# EAGLE design elektrosluch (EAGLE 7.4.0)
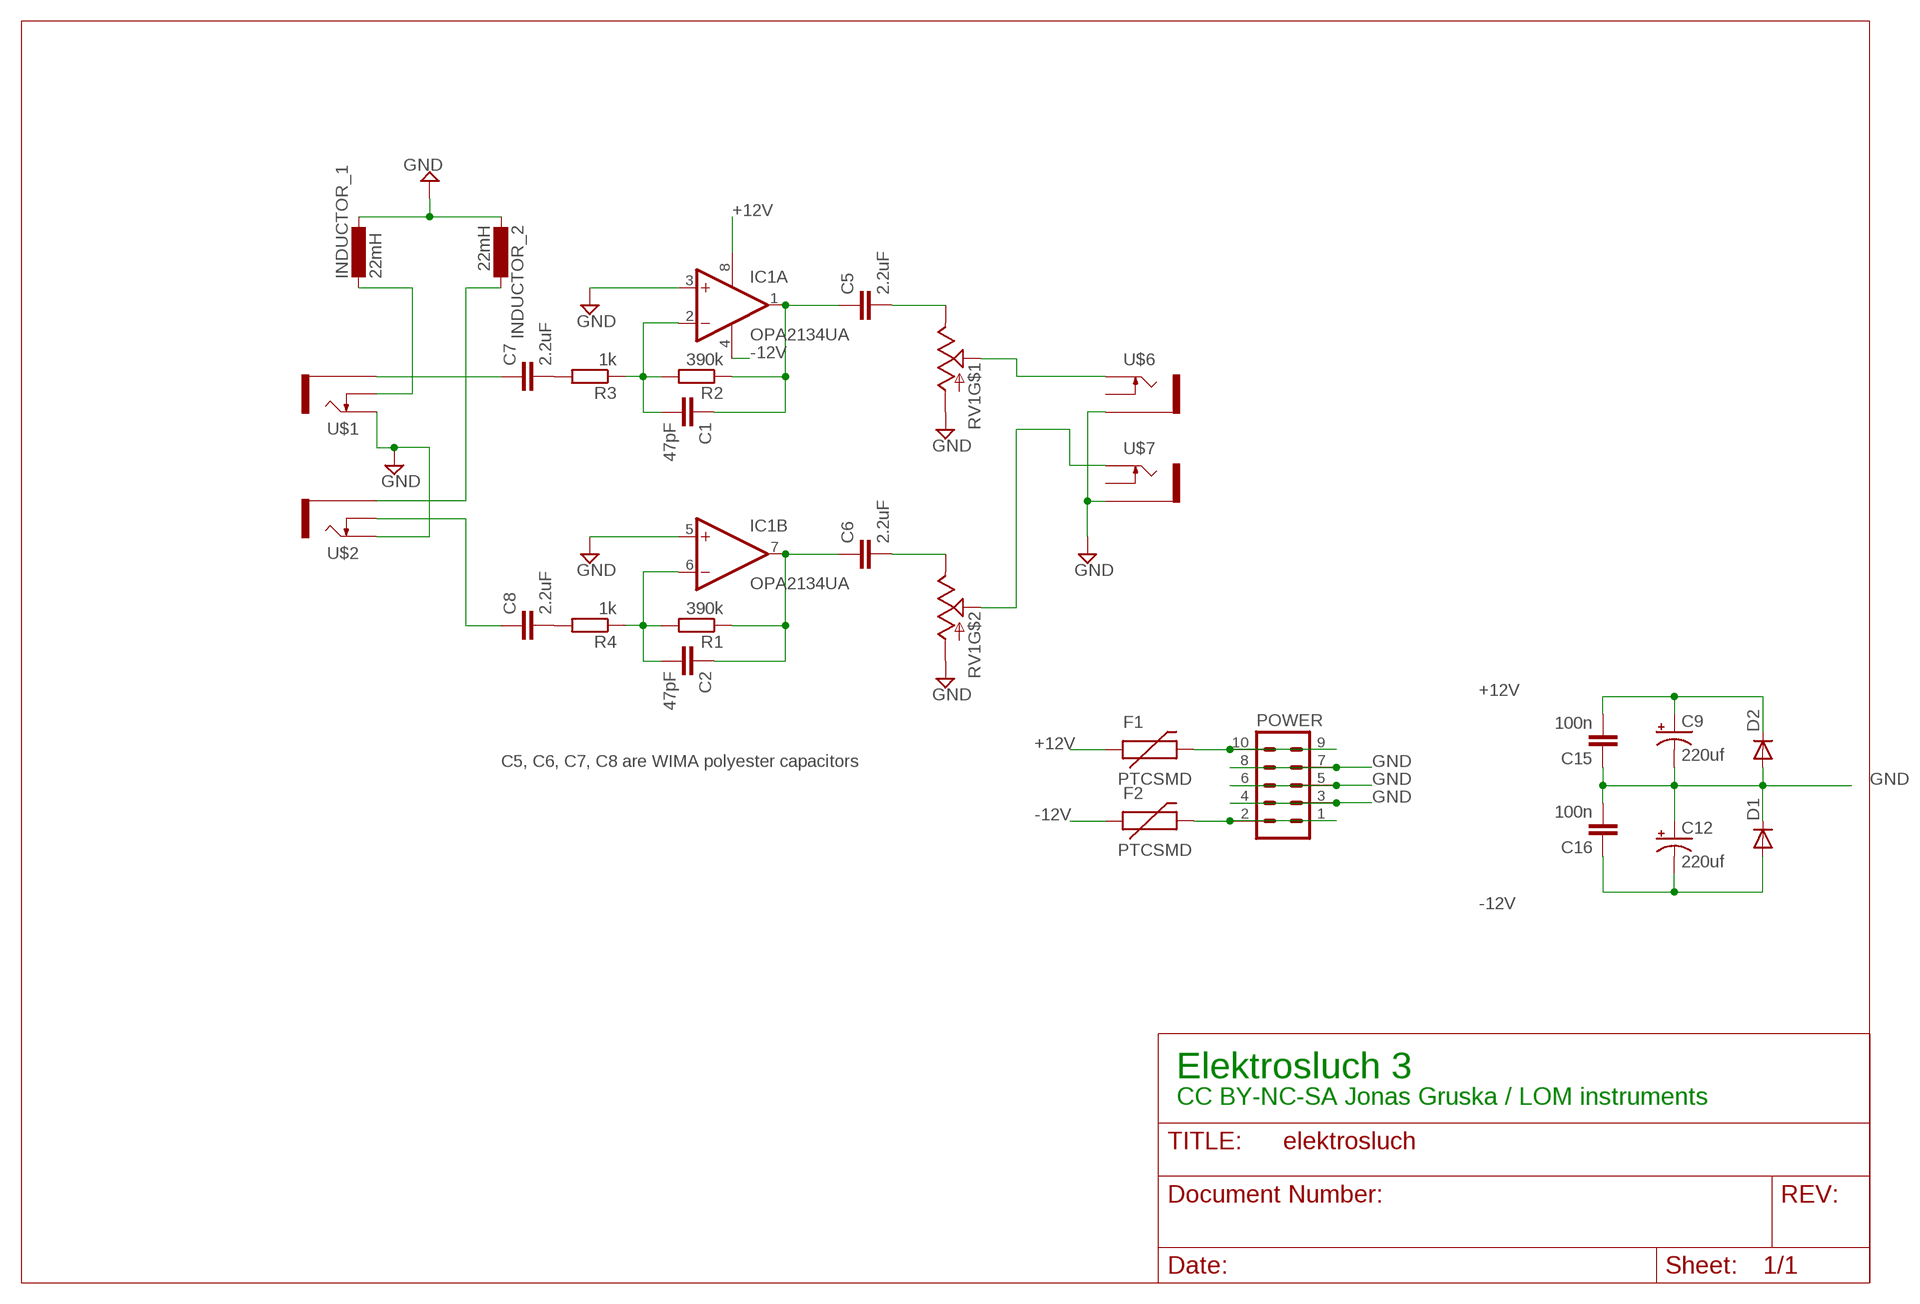
[diagram p0: schematic, sheet 1]

## Parts
C1  47pF  C-EUC0805  [C0805]
C2  47pF  C-EUC0805  [C0805]
C5  2.2uF  WIMA10UF  [WIMA10UF]
C6  2.2uF  WIMA10UF  [WIMA10UF]
C7  2.2uF  WIMA10UF  [WIMA10UF]
C8  2.2uF  WIMA10UF  [WIMA10UF]
C9  220uf  CAP_POLPTH2  [CPOL-RADIAL-10UF-25V]
C12  220uf  CAP_POLPTH2  [CPOL-RADIAL-10UF-25V]
C15  100n  C-EU0805_CAP  [R0805]
C16  100n  C-EU0805_CAP  [R0805]
D1  DIODE-SOD123  [SOD123]
D2  DIODE-SOD123  [SOD123]
F1  PTCSMD  [PTC-1206]
F2  PTCSMD  [PTC-1206]
IC1  OPA2134UA  [SO08]
INDUCTOR_1  22mH  COIL  [COIL]
INDUCTOR_2  22mH  COIL  [COIL]
POWER  10_PIN_HEADER  [MA05-2]
R1  390k  R-EU_R0805  [R0805]
R2  390k  R-EU_R0805  [R0805]
R3  1k  R-EU_R0805  [R0805]
R4  1k  R-EU_R0805  [R0805]
RV1  POT_DUAL  [POT_PANASONIC_DUAL_VERT_KIT]
U$1  THONKICONNNEW  [WQP-PJ301M-12_JACK]
U$2  THONKICONNNEW  [WQP-PJ301M-12_JACK]
U$6  THONKICONNNEW  [WQP-PJ301M-12_JACK]
U$7  THONKICONNNEW  [WQP-PJ301M-12_JACK]

## Nets
+12V: C9.1(+) C15.2 D2.C F1.1 IC1.8(A:V+)
-12V: C12.2(-) C16.1 D1.A F2.1 IC1.4(A:V-)
GND: C9.2(-) C12.1(+) C15.1 C16.2 D1.C D2.A IC1.3(A:+IN) IC1.5(B:+IN) INDUCTOR_1.P$1 INDUCTOR_2.P$2 POWER.3 POWER.4 POWER.5 POWER.6 POWER.7 POWER.8 RV1.A3(A) RV1.B3(A) U$1.P$1_TIP(TIP) U$2.P$1_TIP(TIP) U$6.P$3_SLEEVE(SLEEVE) U$7.P$3_SLEEVE(SLEEVE)
N$1: C1.2 IC1.2(A:-IN) R2.2 R3.1
N$2: C1.1 C5.P$1 IC1.1(A:OUT) R2.1
N$3: C5.P$2 RV1.A1(E)
N$4: C2.2 IC1.6(B:-IN) R1.2 R4.1
N$5: C2.1 C6.P$1 IC1.7(B:OUT) R1.1
N$6: C6.P$2 RV1.B1(E)
N$7: RV1.A2(S) U$6.P$1_TIP(TIP)
N$8: C7.P$1 U$1.P$3_SLEEVE(SLEEVE)
N$9: RV1.B2(S) U$7.P$1_TIP(TIP)
N$10: C8.P$1 U$2.P$2_SWITCH(SWITCH)
N$11: C7.P$2 R3.2
N$12: INDUCTOR_1.P$2 U$1.P$2_SWITCH(SWITCH)
N$13: INDUCTOR_2.P$1 U$2.P$3_SLEEVE(SLEEVE)
N$14: F1.2 POWER.9 POWER.10
N$15: C8.P$2 R4.2
N$16: F2.2 POWER.1 POWER.2
Unconnected: U$6.P$2_SWITCH(SWITCH) U$7.P$2_SWITCH(SWITCH)

## Notes on the sheet
- C5, C6, C7, C8 are WIMA polyester capacitors
- Elektrosluch 3
- CC BY-NC-SA Jonas Gruska / LOM instruments

## Library data of the parts
C1 C2 = rcl:C-EU: CAPACITOR, European symbol
C5-C8 = mojakniznica:WIMA10UF
C9 C12 = SparkFun-Passives:CAP_POL: Capacitor Polarized These are standard SMD and PTH capacitors. Normally 10uF, 47uF, and 100uF in electrolytic and tantalum varieties. Always verify the external diameter of the through hole cap, it varies with capacity, voltage, and manufacturer. The EIA devices should be standard.
C15 C16 = TomW:C-EU: CAPACITOR, European symbol
D1 D2 = diode:DIODE-: DIODE
F1 F2 = SparkFun-PowerIC:PTC: Resettable Fuse PTC Resettable Fuse. Spark Fun Electronics SKU : COM-08357; PROD_ID: RES-11150
IC1 = linear:OPA2*: Dual Operational Amplifier Low Power, Single-Supply, Rail-To-Rail Operational Amplifier Source: http://focus.ti.com/lit/ds/symlink/opa2345.pdf http://focus.ti.com .. opa241.pdf http://focus.ti.com/lit/ds/symlink/opa2134.pdf
INDUCTOR_1 INDUCTOR_2 = mojakniznica:COIL
POWER = TomW:10_PIN_HEADER: PIN HEADER; OC_FARNELL: unknown; OC_NEWARK: unknown
R1-R4 = rcl:R-EU_: RESISTOR, European symbol
RV1 = SparkFun-Electromechanical:POT_DUAL; DIST: digikey; DIST_ID: P2A5103-ND; PROD_ID: RES-11897
U$1 U$2 U$6 U$7 = MusicThingModular:THONKICONN: 3.5mm socket for Eurorack modular synths

## Net classes
0 default1: width 0.305 mm
1 power1: width 0.61 mm
2 ground1: width 0.61 mm
3 power: width 0.305 mm

## Board
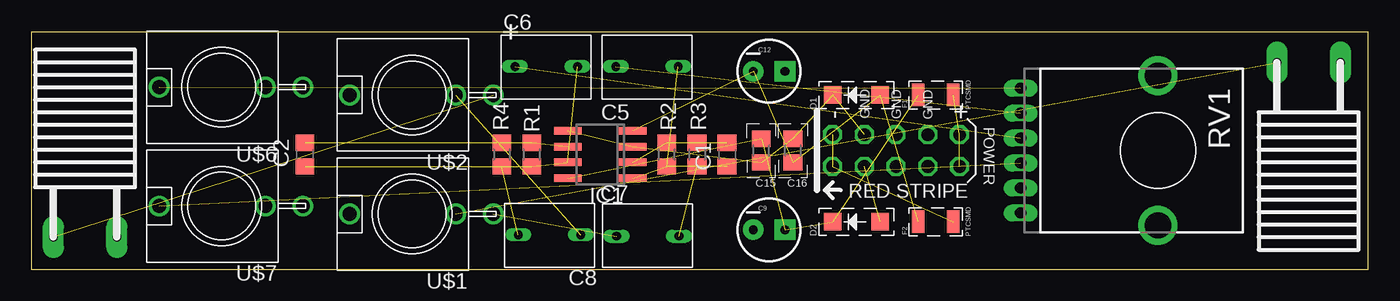
[diagram p1: board, top side]
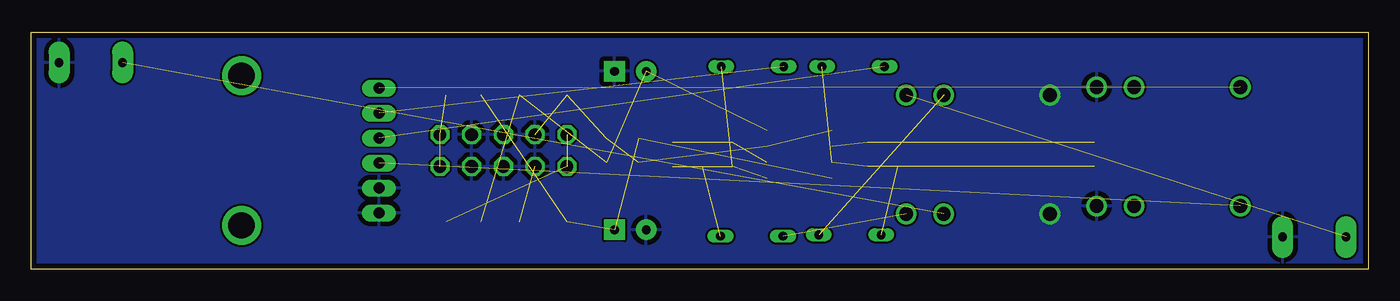
[diagram p2: board, bottom side, seen from below]

Size 107 x 19 mm. Coordinates in mm from the lower left corner, seen from the top.
Outline: 0,0 107,0 107,19 0,19 0,0
Copper layers (1*16): Top 0.0356mm / dielectric 1.5011mm / Bottom 0.0356mm
Design rules "LaenPCBOrder *": minimum track width 6mil, minimum drill 13mil, track to track 6mil, track to pad 6mil, pad to pad 6mil, via to via 6mil, smd to smd 6mil, copper to edge 15mil, drill to drill 6mil, minimum pad ring 7mil, minimum via ring 7mil, stop-mask expansion 3mil, vias tented up to drill 0mil, thermal gap 15mil

### Footprints (pad centres in the part's own frame; a part is rotated, then mirrored left to right if it is on the bottom)
C0805 = smd 1.3 x 1.5: 1 -0.95,0; 2 0.95,0
WIMA10UF = drill 0.7 long: P$1 -2.5,0; P$2 2.5,0
CPOL-RADIAL-10UF-25V = drill 0.7 pad 1.651 square: 1 1.27,0 | drill 0.7 pad 1.651: 2 -1.27,0
R0805 = smd 1.3 x 1.5: 1 -0.95,0; 2 0.95,0
SOD123 = smd 1.4 x 1.4: A 1.9,0; C -1.9,0
PTC-1206 = smd 1 x 1.8: 1 -1.4,0; 2 1.4,0
SO08 = smd 0.6 x 2.2: 1 -1.905,-2.6; 2 -0.635,-2.6; 3 0.635,-2.6; 4 1.905,-2.6; 5 1.905,2.6; 6 0.635,2.6; 7 -0.635,2.6; 8 -1.905,2.6
COIL = drill 0.7 pad 1.676 long: P$1 -2.54,0; P$2 2.54,0
MA05-2 = drill 1.016 octagon: 1 -5.08,-1.27; 2 -5.08,1.27; 3 -2.54,-1.27; 4 -2.54,1.27; 5 0,-1.27; 6 0,1.27; 7 2.54,-1.27; 8 2.54,1.27; 9 5.08,-1.27; 10 5.08,1.27
POT_PANASONIC_DUAL_VERT_KIT = drill 0.9 long: A1 11,-3; A2 11,-5; A3 11,5; B1 11,-1; B2 11,1; B3 11,3 | drill 2.1: P$4 0,-6; P$5 0,6
WQP-PJ301M-12_JACK = drill 1.1: P$1_TIP 0,5; P$2_SWITCH 0,-3.5; P$3_SLEEVE 0,-6.5

### Placement (x,y rotation side)
C1  55.69,9.21 90 top
C2  21.91,9.21 90 top
C5  49.28,16.26 180 top
C6  41.21,16.26 180 top
C7  49.34,2.67 0 top
C8  41.48,2.77 180 top
C9  59.05,3.17 0 top
C12  59.05,15.88 0 top
C15  58.42,9.53 90 top
C16  60.96,9.53 90 top
D1  66.04,13.97 0 top
D2  66.04,3.81 0 top
F1  72.39,13.97 0 top
F2  72.39,3.81 0 top
IC1  45.53,9.21 90 top
INDUCTOR_1  102.23,16.57 180 top
INDUCTOR_2  4.32,2.6 0 top
POWER  69.22,9.53 0 top
R1  40.07,9.21 90 top
R2  50.86,9.21 90 top
R3  53.28,9.21 270 top
R4  37.66,9.21 270 top
RV1  90.17,9.53 180 top
U$1  30.48,4.45 90 top
U$2  30.48,13.97 90 top
U$6  15.24,14.61 90 top
U$7  15.24,5.08 90 top

### Tracks (layer width: path | path; a pad name or v marks a point on that pad's centre or on a via)
+12V  (4 unrouted)
-12V  (4 unrouted)
GND  (6 unrouted)
  pour Bottom: 0,0 107.31,0 107.31,19.05 0,19.05
N$1  (3 unrouted)
N$2  (3 unrouted)
N$3  (1 unrouted)
N$4  (3 unrouted)
N$5  (3 unrouted)
N$6  (1 unrouted)
N$7  (1 unrouted)
N$8  (1 unrouted)
N$9  (1 unrouted)
N$10  (1 unrouted)
N$11  (1 unrouted)
N$12  (1 unrouted)
N$13  (1 unrouted)
N$14  (2 unrouted)
N$15  (1 unrouted)
N$16  (2 unrouted)

### Text on the board
tNames: +
tStop: Designed by / Jonas Gruska / & Birch Cooper